# Altium project Adapter_MPCIe_to_M2_E.PrjPcb
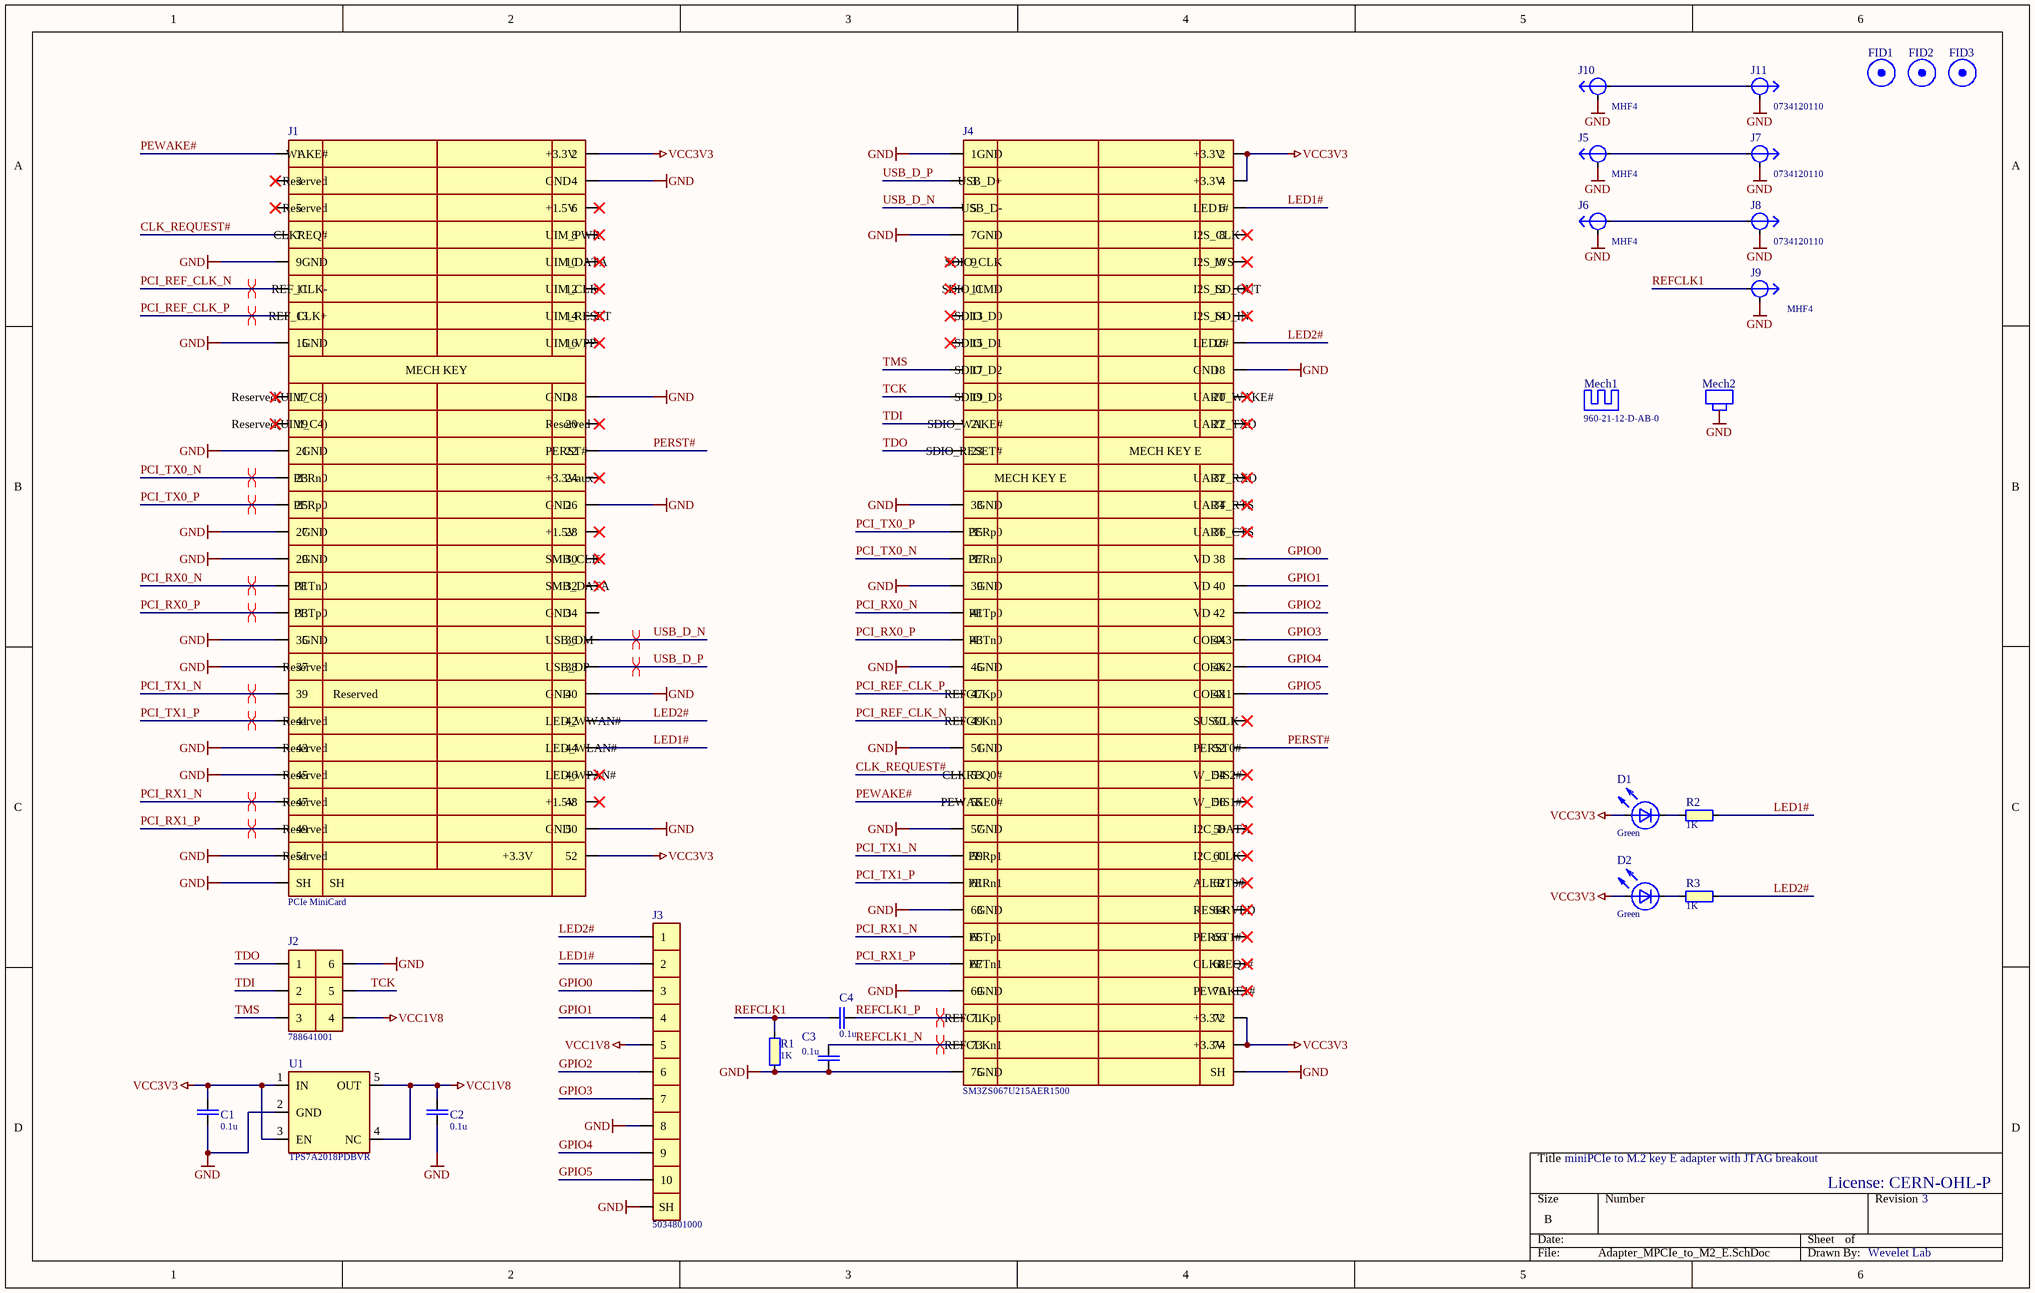
[diagram p0: Adapter_MPCIe_to_M2_E.SchDoc]
Revision: REV.0
1 sheet, 26 parts. Net scope: global (net labels, ports and power ports of the same name join across sheets).
Board file: Adapter_MPCIe_to_M2_E.PcbDoc

## Sheet Adapter_MPCIe_to_M2_E.SchDoc
size B

### Parts
C1  value 0.1u  [CAPC100X50X55L25N]  (hidden comment: GRM155R71E104KE14D)
C2  value 0.1u  [CAPC100X50X55L25N]  (hidden comment: GRM155R71E104KE14D)
C3  value 0.1u  [CAPC100X50X55L25N]  (hidden comment: GRM155R71E104KE14D)
C4  value 0.1u  [CAPC100X50X55L25N]  (hidden comment: GRM155R71E104KE14D)
D1  value Green  [LEDC160X80X80L40N-Green]  (hidden comment: LTST-C190KGKT)
D2  value Green  [LEDC160X80X80L40N-Green]  (hidden comment: LTST-C190KGKT)
FID1  Fiducial  [Fiducial_2D]  (value not drawn)  (no BOM)
FID2  Fiducial  [Fiducial_2D]  (value not drawn)  (no BOM)
FID3  Fiducial  [Fiducial_2D]  (value not drawn)  (no BOM)
J1  value PCIe MiniCard  [EDGE_CONN_PCIe_MiniCard]  (hidden comment: Edge connector PCIe MiniCard)  (no BOM)
J2  value 788641001  [Molex_788641001_Mating]  (hidden comment: 788641001_Mating)  (no BOM)
J3  5034801000  [MOLEX_5034801000]
J4  SM3ZS067U215AER1500  [JAE_SM3ZS067U215AER1500]
J5  value MHF4  [LINX_CONMHF4-SMD-G-T]  (hidden comment: CONMHF4-SMD-G-T)
J6  value MHF4  [LINX_CONMHF4-SMD-G-T]  (hidden comment: CONMHF4-SMD-G-T)
J7  0734120110  [MOLEX_734120110]
J8  0734120110  [MOLEX_734120110]
J9  value MHF4  [LINX_CONMHF4-SMD-G-T]  (hidden comment: CONMHF4-SMD-G-T)
J10  value MHF4  [LINX_CONMHF4-SMD-G-T]  (hidden comment: CONMHF4-SMD-G-T)
J11  0734120110  [MOLEX_734120110]
Mech1  960-21-12-D-AB-0  [WAKEFIELD_960-21-12-D-AB-0]
Mech2  SM3ZS067U215-NUT1-R2500  [JAE_SM3ZS067U215-NUT1]  (value not drawn)
R1  value 1K  [RESC100X50X40L20N]  (hidden comment: Res-0402-1K-5%)
R2  value 1K  [RESC100X50X40L20N]  (hidden comment: Res-0402-1K-5%)
R3  value 1K  [RESC100X50X40L20N]  (hidden comment: Res-0402-1K-5%)
U1  TPS7A2018PDBVR  [SOT23-5P95_280X145L45X40N]

### Nets
GND: C1.1 C2.1 C3.1 J1.4 J1.9 J1.15 J1.18 J1.21 J1.26 J1.27 J1.29 J1.35 J1.37 J1.40 J1.43 J1.45 J1.50 J1.51 J1.SH J2.6 J3.8 J3.SH J4.1 J4.7 J4.18 J4.33 J4.39 J4.45 J4.51 J4.57 J4.63 J4.69 J4.75 J4.SH J5.SH J6.SH J7.SH J8.SH J9.SH J10.SH J11.SH Mech2.SH R1.2 U1.2(GND)
VCC1V8: C2.2 J2.4 J3.5 U1.4(NC) U1.5(OUT)
VCC3V3: C1.2 D1.A D2.A J1.2 J1.52 J4.2 J4.4 J4.72 J4.74 U1.1(IN) U1.3(EN)
CLK_REQUEST#: J1.7 J4.53
GPIO0: J3.3 J4.38
GPIO1: J3.4 J4.40
GPIO2: J3.6 J4.42
GPIO3: J3.7 J4.44
GPIO4: J3.9 J4.46
GPIO5: J3.10 J4.48
LED1#: J1.44 J3.2 J4.6 R2.1
LED2#: J1.42 J3.1 J4.16 R3.1
PCI_REF_CLK_N: J1.11 J4.49
PCI_REF_CLK_P: J1.13 J4.47
PCI_RX0_N: J1.31 J4.41
PCI_RX0_P: J1.33 J4.43
PCI_RX1_N: J1.47 J4.65
PCI_RX1_P: J1.49 J4.67
PCI_TX0_N: J1.23 J4.37
PCI_TX0_P: J1.25 J4.35
PCI_TX1_N: J1.39 J4.59
PCI_TX1_P: J1.41 J4.61
PERST#: J1.22 J4.52
PEWAKE#: J1.1 J4.55
REFCLK1: C4.1 J9.1 R1.1
REFCLK1_N: C3.2 J4.73
REFCLK1_P: C4.2 J4.71
TCK: J2.5 J4.19
TDI: J2.2 J4.21
TDO: J2.1 J4.23
TMS: J2.3 J4.17
USB_D_N: J1.36 J4.5
USB_D_P: J1.38 J4.3
NetD1_C: D1.C R2.2
NetD2_C: D2.C R3.2
NetJ5_1: J5.1 J7.1
NetJ6_1: J6.1 J8.1
NetJ10_1: J10.1 J11.1

Not connected (* = marked no-connect by the designer): J1 3* 5* 6* 8* 10* 12* 14* 16* 17* 19* 20* 24* 28* 30* 32* 34 46* 48*; J4 8* 9* 10* 11* 12* 13* 14* 15* 20* 22* 32* 34* 36* 50* 54* 56* 58* 60* 62* 64* 66* 68* 70*; Mech1 MH

### Layout directives
differential pair: PCI_REF_CLK_N, PCI_REF_CLK_P, PCI_RX0_N, PCI_RX0_P, PCI_RX1_N, PCI_RX1_P, PCI_TX0_N, PCI_TX0_P, PCI_TX1_N, PCI_TX1_P, REFCLK1_N, REFCLK1_P, USB_D_N, USB_D_P

### Notes on the sheet
- miniPCIe to M.2 key E adapter with JTAG breakout
- License: CERN-OHL-P
- 3
- Wevelet Lab
- (in symbol Edge connector PCIe MiniCard) WAKE#; +3.3V; Reserved; GND; +1.5V; CLKREQ#; UIM_PWR; UIM_DATA; REF_CLK-; UIM_CLK; REF_CLK+; UIM_RESET; UIM_VPP; MECH KEY; Reserved(UIM_C8); Reserved(UIM_C4); PERST#; PERn0; +3.3Vaux; PERp0; SMB_CLK; PETn0; SMB_DATA; PETp0; USB_DM; USB_DP; LED_WWAN#; LED_WLAN#; LED_WPAN#
- (in symbol SM3ZS067U215AER1500) GND; +3.3V; USB_D+; USB_D-; LED1#; I2S_CLK; SDIO_CLK; I2S_WS; SDIO_CMD; I2S_SD_OUT; SDIO_D0; I2S_SD_IN; SDIO_D1; LED2#; SDIO_D2; SDIO_D3; UART_WAKE#; SDIO_WAKE#; UART_TXD; SDIO_RESET#; MECH KEY E; UART_RXD; UART_RTS; PERp0; UART_CTS; PERn0; VD; PETp0; PETn0; COEX3; COEX2; REFCLKp0; COEX1; REFCLKn0; SUSCLK; PERST0#; CLKREQ0#; W_DIS2#; PEWAKE0#; W_DIS1#; I2C_DATA; PERp1; I2C_CLK; PERn1; ALERT0#; RESERVED; PETp1; PERST1#; PETn1; CLKREQ1#; PEWAKE1#; REFCLKp1; REFCLKn1

### Library data of the parts
C1-C4 = GRM155R71E104KE14D: Capacitor, 0.1u, 25V, 10%, X7R, 0402; Manufacturer: Murata Electronics
D1 D2 = LTST-C190KGKT: LED Diode, Green, -30/+85, SMD0603; Manufacturer: Lite-On Inc.
J2 = 788641001_Mating: Conn, Mating, 788641001; Manufacturer: Molex
J3 = 5034801000: Conn, FFC, 10 pins, 0.5mm, -40/+85, Right, SMD; Manufacturer: Molex; Value: 5034801000
J4 = SM3ZS067U215AER1500: Conn M.2, Key E, -40/+80, SMD; Manufacturer: JAE; Value: SM3ZS067U215AER1500
J5 J6 J9 J10 = CONMHF4-SMD-G-T: Conn, IPEX MHF4, Male Pin, 50 Ohm, -65/+165, SMD; Manufacturer: Linx Technologies Inc.; Name: CONMHF4-SMD-G-T
J7 J8 J11 = 0734120110: Conn, U.FL (UMCC), Male Pin, 50 Ohm, -40/+90, SMD; Manufacturer: Molex; Value: 0734120110
Mech1 = 960-21-12-D-AB-0: Mech, Heatsink, 21x12 mm, front, push pins; Manufacturer: Wakefield; Value: 960-21-12-D-AB-0
Mech2 = SM3ZS067U215-NUT1-R2500: Mech, standoff, M2, 0.35 mm; Manufacturer: JAE; Value: SM3ZS067U215-NUT1-R2500
R1-R3 = Res-0402-1K-5%: Resistor, 1K, 0.063W, 5%, 0402
U1 = TPS7A2018PDBVR: IC, VolReg, DC/DC, 2.2/5.5V, 1.8V, 0.25A, -40/+125, 4-X2SON; Manufacturer: Texas Instruments; Value: TPS7A2018PDBVR
FID1-FID3 = Fiducial: Manufacturer: *; Value: *
J1 = Edge connector PCIe MiniCard: Manufacturer: *